# Altium project 05_MCU_LORA.PrjPCB
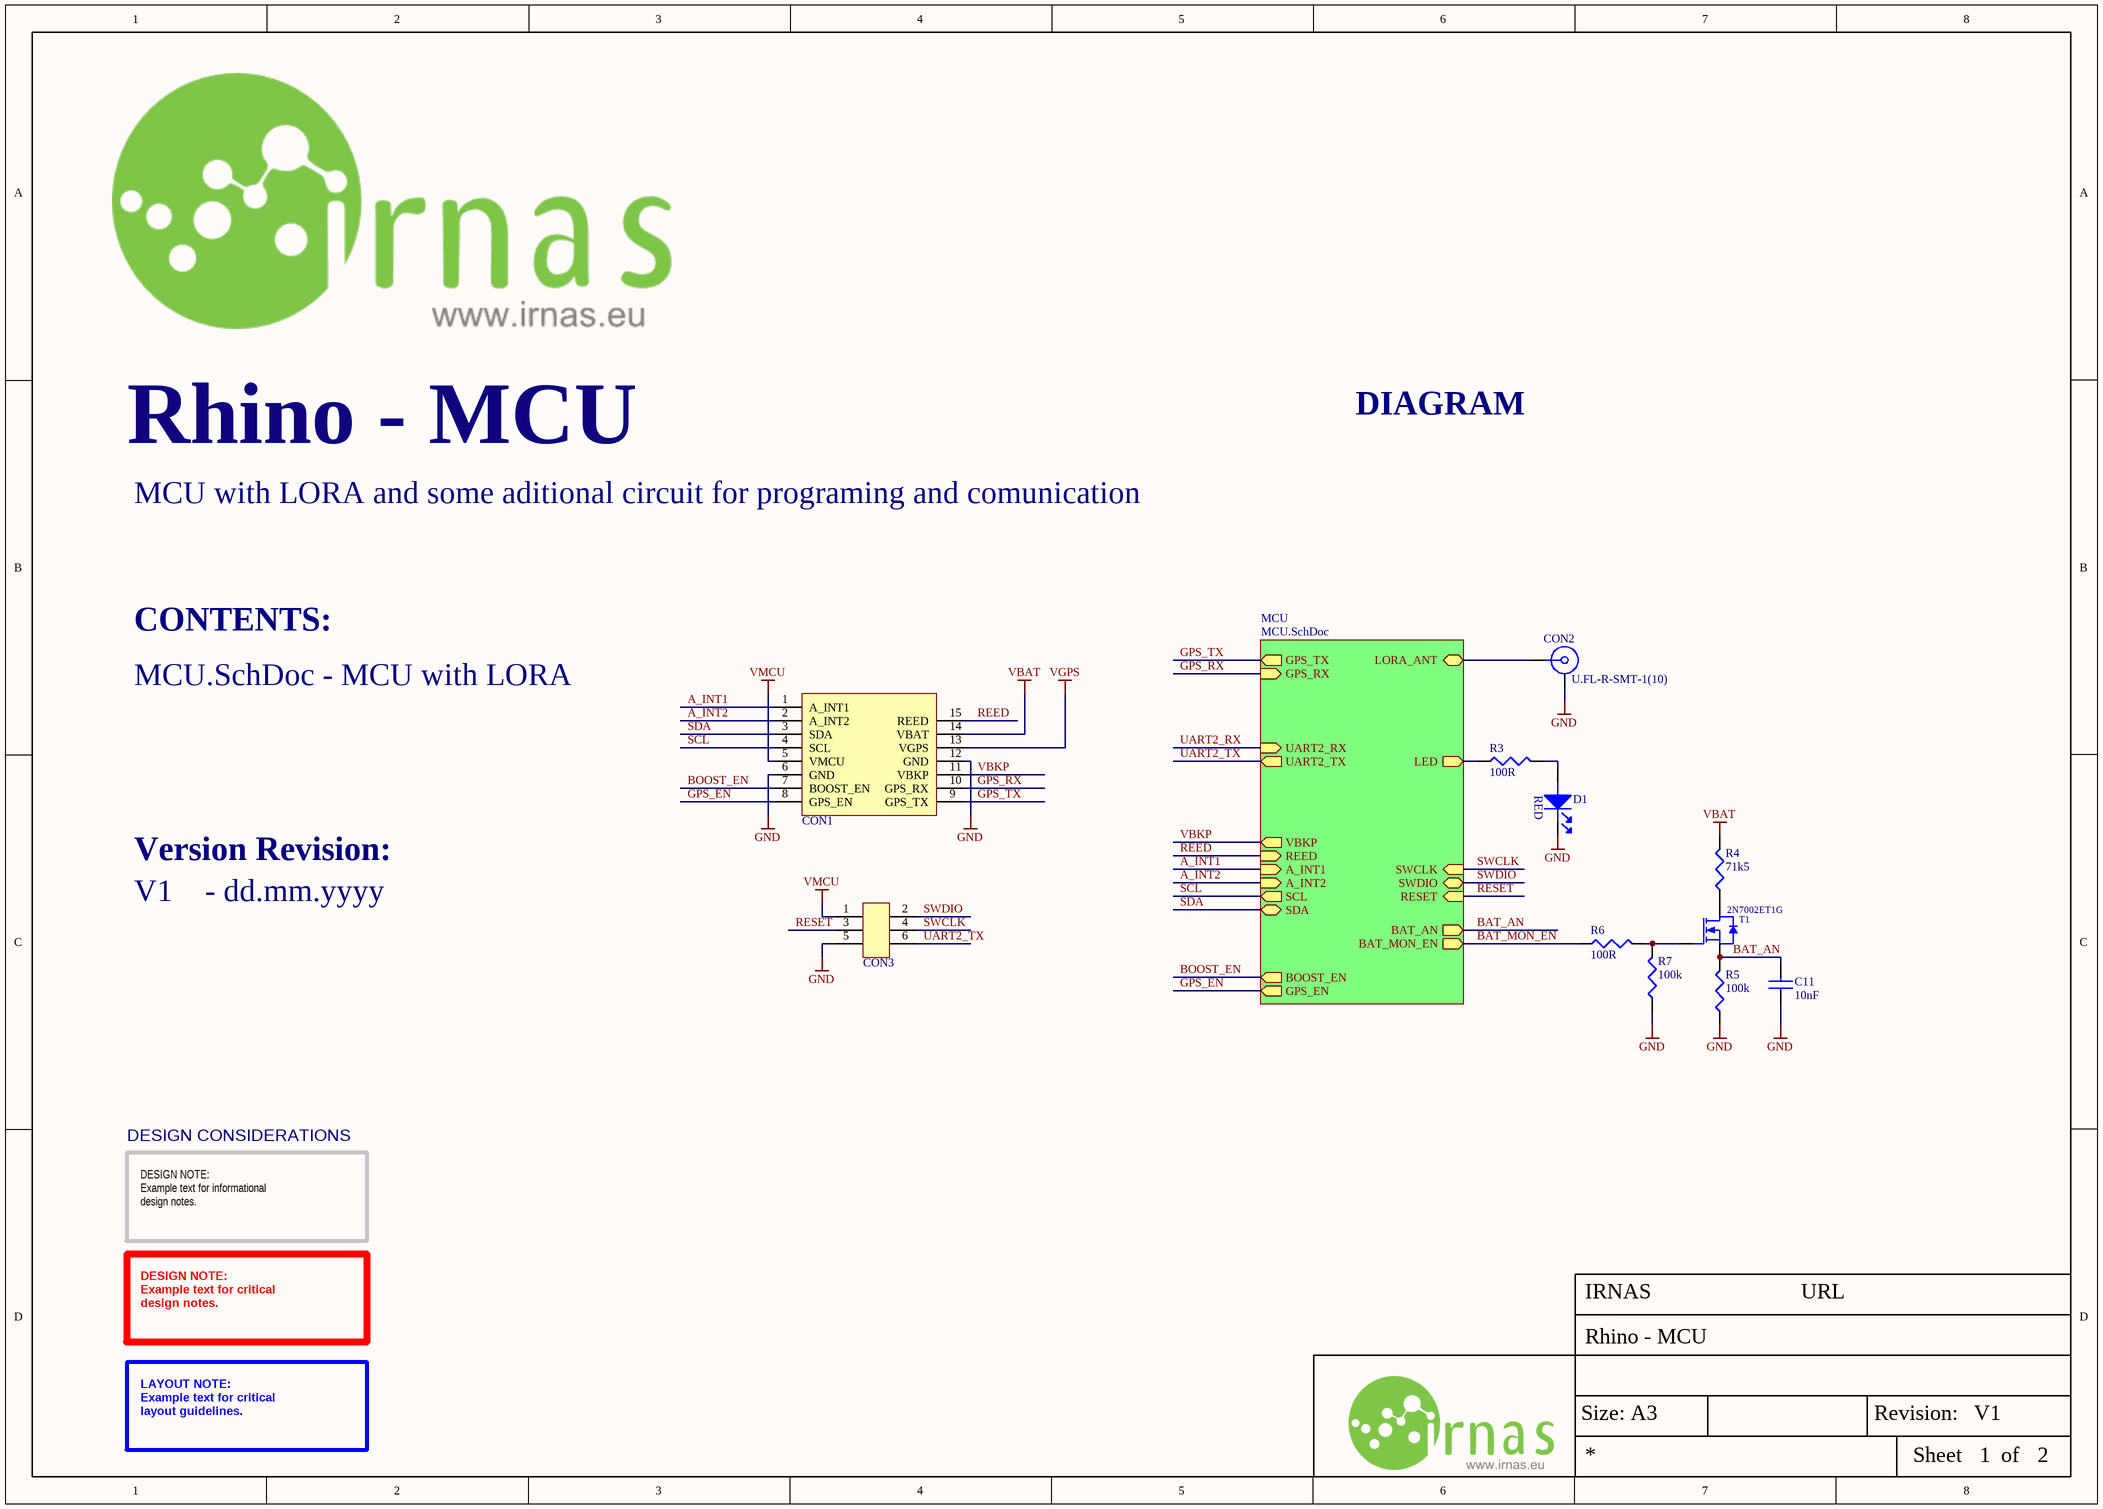
[diagram p0: MAIN_MCU_LORA.SchDoc]
Company: IRNAS; CreateDate: 13.05.2019; PCBDesigner: Aleksej Cegner; ProjectTitle: Rhino - MCU; RevisionDate: dd.mm.yyyy; Version: V1; Website: URL
2 sheets, 20 parts. Net scope: hierarchical (ports join the sheet entries above them; power ports are global).
Board files: MCU_LORA.PcbDoc, Rhino_panel.PcbDoc, Rhino_panel_s.PcbDoc
Sheets:
  MAIN_MCU_LORA.SchDoc
    MCU = MCU.SchDoc

## Sheet MAIN_MCU_LORA.SchDoc
size A3; DocumentNumber: 1; SheetNumber: 1; SheetTotal: 2

### Parts
C11  10nF  [CAP0402]
CON1  Between PCB connection  [SmartParks_Rhino]  (value not drawn)
CON2  U.FL-R-SMT-1(10)  [ufl connector smd]
CON3  Tag connect  [TC2030-IDC-NL]  (value not drawn)  (no BOM)
D1  LED RED  [LED0603]  (value not drawn)
R3  100R  [RES0402]
R4  71k5  [RES0402]
R5  100k  [RES0402]
R6  100R  [RES0402]
R7  100k  [RES0402]
T1  2N7002ET1G  [SOT23-3AL]

### Sub-sheets
MCU = MCU.SchDoc: RESET (in), GPS_RX (in), SCL (out), LORA_ANT (bidir), SWDIO (bidir), GPS_EN (out), GPS_TX (out), SWCLK (in), SDA (bidir), BOOST_EN (out), A_INT2 (in), A_INT1 (in), REED (in), VBKP (out), BAT_AN (out), BAT_MON_EN (out), LED (out), UART2_RX (in), UART2_TX (out)

### Nets
GND: C11.1 CON1.6(GND) CON1.12(GND) CON2.2 CON3.5 D1.1(cathode) R5.1 R7.1
VBAT: CON1.14(VBAT) R4.2
VGPS: CON1.13(VGPS)
VMCU: CON1.5(VMCU) CON3.1
A_INT1: CON1.1(A_INT1) ; sheet MCU/A_INT1
A_INT2: CON1.2(A_INT2) ; sheet MCU/A_INT2
BAT_AN: C11.2 R5.2 T1.2(S) ; sheet MCU/BAT_AN
BAT_MON_EN: R6.1 ; sheet MCU/BAT_MON_EN
BOOST_EN: CON1.7(BOOST_EN) ; sheet MCU/BOOST_EN
GPS_EN: CON1.8(GPS_EN) ; sheet MCU/GPS_EN
GPS_RX: CON1.10(GPS_RX) ; sheet MCU/GPS_RX
GPS_TX: CON1.9(GPS_TX) ; sheet MCU/GPS_TX
LED: R3.1 ; sheet MCU/LED
LORA_ANT: CON2.1 ; sheet MCU/LORA_ANT
REED: CON1.15(REED) ; sheet MCU/REED
RESET: CON3.3 ; sheet MCU/RESET
SCL: CON1.4(SCL) ; sheet MCU/SCL
SDA: CON1.3(SDA) ; sheet MCU/SDA
SWCLK: CON3.4 ; sheet MCU/SWCLK
SWDIO: CON3.2 ; sheet MCU/SWDIO
UART2_TX: CON3.6 ; sheet MCU/UART2_TX
VBKP: CON1.11(VBKP) ; sheet MCU/VBKP
NetD1_2: D1.2(ANODE) R3.2
NetR4_1: R4.1 T1.3(D)
NetR6_2: R6.2 R7.2 T1.1(G)

### Notes on the sheet
- DIAGRAM
- MCU with LORA and some aditional circuit for programing and comunication
- CONTENTS:
- MCU.SchDoc - MCU with LORA
- Version Revision:
- V1    - dd.mm.yyyy
- DESIGN CONSIDERATIONS
- DESIGN NOTE:
  Example text for informational
  design notes.
- DESIGN NOTE:
  Example text for critical
  design notes.
- LAYOUT NOTE:
  Example text for critical
  layout guidelines.
- Size: A3
- Revision:
- Sheet
- of
- (in symbol LED - LED RED) RED

### Library data of the parts
C11 = C - 10nF/0402: CAP CER 10000PF 16V X7R 0402; Manufacturer: Murata; Manufacturer Part Number: GRM155R71C103KA01D; IRNAS Part No.: /; Tolerance: 10%; Supplier 1: Farnell; Stock 1: 16478; Pricing 1: 10=0.0216, 100=0.0151, 500=0.0104, 2500=0.0069, 5000=0.0056 (EUR); Mount: Surface Mount; Case/Package: 0402; Number of Pins: 2; Case Code (Metric): 1005; Case Code (Imperial): 0402; Min Operating Temperature: -55°C; Max Operating Temperature: 125°C; Package Quantity: 1; Capacitance: 10nF; Voltage Rating: 16V; Packaging: Tape and Reel; Voltage Rating (DC): 16V; Dielectric: X7R; Termination: SMD/SMT; Voltage: 16V; Length: 1mm; Height: 0.5mm; Width: 0.02inch; Thickness: 0.022inch; Depth: 0.5mm; Radiation Hardening: No; REACH SVHC: No SVHC; Lead Free: Lead Free; ComponentLink1URL: https://datasheet.ciiva.com/129/partnumbering-e-01-129774.pdf; ComponentLink1Description: https://datasheet.ciiva.com/129/partnumbering-e-01-129774.pdf; ComponentLink2URL: https://datasheet.ciiva.com/129/partnumbering-e-01-129775.pdf; ComponentLink2Description: https://datasheet.ciiva.com/129/partnumbering-e-01-129775.pdf; ComponentLink3URL: https://datasheet.ciiva.com/129/product-129776.pdf; ComponentLink3Description: https://datasheet.ciiva.com/129/product-129776.pdf; ComponentLink4URL: https://datasheet.ciiva.com/18184/getdatasheetpartid-178863-18184649.pdf; ComponentLink4Description: https://datasheet.ciiva.com/18184/getdatasheetpartid-178863-18184649.pdf; ComponentLink5URL: https://datasheet.ciiva.com/22698/608985-22698415.pdf; ComponentLink5Description: https://datasheet.ciiva.com/22698/608985-22698415.pdf; ComponentLink6URL: https://datasheet.ciiva.com/7937/608985-7937614.pdf; ComponentLink6Description: https://datasheet.ciiva.com/7937/608985-7937614.pdf; Supplier Part Number 1: 1828864
CON1 = SmartParks_Rhino
CON2 = U.FL-R-SMT-1(10): RF / Coaxial Connector, U.FL Coaxial, Straight Jack, Surface Mount Vertical, 50 ohm, Brass; Manufacturer: Hirose; Featured Product: U.FL Series Connectors; Connector Style: U.FL, Ultra Miniature Coaxial; Connector Type: Receptacle, Male Pin; Contact Termination: Solder; Impedance: 50 Ohm; Frequency - Max: 6GHz; Body Material: Phosphor Bronze; Body Finish: Silver; Center Contact Plating: Gold; Dielectric Material: Liquid Crystal Polymer (LCP); Online Catalog: UMCC (Ultra Miniature Coax Connectors), U.FL Series; Other Names: H11891TR  Q5400621  U.FL-R-SMT-1 10  U.FL-R-SMT-1(10)-ND  UFLRSMT110; Supplier 1: Farnell; Manufacturer Part Number: U.FL-R-SMT-1(10); Stock 1: 0; Standard Package: 2,500; Category: Connectors, Interconnects; Family: Coaxial Connectors (RF); Series: U.FL; Packaging: Tape & Reel (TR); Shield Termination: Solder; Mounting Type: Surface Mount; Cable Group: -; Fastening Type: Snap-On; Features: -; Housing Color: Beige; Ingress Protection: -; Center Contact Material: Brass; Voltage Rating: -; Operating Temperature: -40°C ~ 90°C; ComponentLink1URL: http://www.farnell.com/datasheets/91524.pdf; ComponentLink1Description: http://www.farnell.com/datasheets/91524.pdf; ComponentLink2URL: http://uk.rs-online.com/webdocs/1363/0900766b81363563.pdf; ComponentLink2Description: http://uk.rs-online.com/webdocs/1363/0900766b81363563.pdf; ComponentLink3URL: http://www.farnell.com/datasheets/1947917.pdf; ComponentLink3Description: http://www.farnell.com/datasheets/1947917.pdf; Supplier Part Number 1: 1688077
CON3 = tag connecot 6 pin
D1 = LED - LED RED: BROADCOM LIMITED - HSMS-C190 - LED, RED, 10MCD, 626NM; LED Mounting: SMD; Forward Current If: 20; Forward Voltage: 2.1; Wavelength Typ: 626; Luminous Intensity: 10; Viewing Angle: 170°; Lens Shape: Rectangular; SVHC: No SVHC (17-Dec-2015)<!--FANDB--><div class="features-and-benefits-container"><div class="features-and-benefits-description"><span class="features-benefits-value">The HSMS-C190 is a HER SMD Chip LED with untinted/diffused lens, made of GaP. It is designed in an industry standard package 1.6 x 0.8mm footprint with 0.8mm profile. It is compatible with IR reflow solder processes. The small size and wide viewing angle make this LED prime choices for backlighting applications and front panel illumination especially where space is a premium.</span></div><div class="features-and-benefits-list"><ul class="features-and-benefits-list-list"><li class="features-and-benefits-list-item">Small size</li><li class="features-and-benefits-list-item">Industry standard footprint</li><li class="features-and-benefits-list-item">Compatible with IR solder</li><li class="features-and-benefits-list-item">Diffused optics</li><li class="features-and-benefits-list-item">-40 to 85; Supplier 1: Farnell; Manufacturer: BROADCOM LIMITED; Manufacturer Part Number: HSMS-C190; RoHS: YES; Stock 1: 7534; Pricing 1: 1=0.361, 10=0.256, 50=0.235, 100=0.106, 200=0.101 (GBP); LED Colour: Red; Bulb Size: -; Packaging: Cut Tape; Product Range: -; Automotive Qualification Standard: -; MSL: -; ComponentLink1URL: http://www.farnell.com/datasheets/313031.pdf; ComponentLink1Description: http://www.farnell.com/datasheets/313031.pdf; ComponentLink2URL: http://www.farnell.com/datasheets/1681524.pdf; ComponentLink2Description: http://www.farnell.com/datasheets/1681524.pdf; ComponentLink3URL: http://www.farnell.com/datasheets/2165483.pdf; ComponentLink3Description: http://www.farnell.com/datasheets/2165483.pdf; Supplier Part Number 1: 2497356
R3 R6 = R - 100R/0402: MULTICOMP         MCMR04X1000FTL            SMD Chip Resistor, Ceramic, MCMR Series, 100 ohm, 50 V, 0402 [1005 Metric], 62.5 mW,  1%; IRNAS Part No.: /; Temperature Coefficient: 100ppm/°C; Power Rating: 62.5mW; Voltage Rating: 50V; Supplier 1: Farnell; Manufacturer: Multicomp; Manufacturer Part Number: MCMR04X1000FTL; Stock 1: 62365; Pricing 1: 10=0.0071, 100=0.0042, 500=0.003, 2500=0.0024, 5000=0.0019 (GBP); Case/Package: 0402; Case Code (Metric): 1005; Case Code (Imperial): 0402; Resistance: 100R; Tolerance: 1%; Composition: Ceramic; Packaging: Cut Tape; Voltage Rating (DC): 50V; REACH SVHC: No SVHC; ComponentLink1URL: https://datasheet.ciiva.com/28692/1716705-28692087.pdf; ComponentLink1Description: https://datasheet.ciiva.com/28692/1716705-28692087.pdf; ComponentLink2URL: https://datasheet.ciiva.com/22708/1716705-22708156.pdf; ComponentLink2Description: https://datasheet.ciiva.com/22708/1716705-22708156.pdf; Supplier Part Number 1: 2072515
R4 = R - 71k5/0402: MULTICOMP         MCMR04X7152FTL            Surface Mount Chip Resistor, Ceramic, MCMR Series, 71.5 kohm, 62.5 mW,  1%, 50 V; IRNAS Part No.: /; Resistance: 71.5kR; Power Rating: 62.5mW; Voltage Rating: 50V; Temperature Coefficient: 100ppm/°C; Manufacturer: Multicomp; Manufacturer Part Number: MCMR04X7152FTL; Stock 1: 34671; Pricing 1: 10=0.0054, 100=0.0048, 500=0.0041, 2500=0.0029, 5000=0.0023, 10000=0.002, 50000=0.0015 (EUR); Case/Package: 0402; Case Code (Metric): 1005; Case Code (Imperial): 0402; Packaging: Cut Tape; Tolerance: 1%; Composition: Ceramic; Voltage Rating (DC): 50V; REACH SVHC: No SVHC; ComponentLink1URL: https://datasheet.ciiva.com/28672/1716706-28672249.pdf; ComponentLink1Description: https://datasheet.ciiva.com/28672/1716706-28672249.pdf; Supplier 1: Farnell; Supplier Part Number 1: 2073227
R5 R7 = R - 100k/0402: MULTICOMP   MCWR04X1003FTL   RES, THICK FILM, 100KOHM, 1%, 0.0625W; IRNAS Part No.: I-100013; Resistance: 100kR; Power Rating: 62.5mW; Voltage Rating: 50V; Temperature Coefficient: 100ppm/°C; Supplier 1: Farnell; Manufacturer: Multicomp; Manufacturer Part Number: MCWR04X1003FTL; Stock 1: 161188; Pricing 1: 10=0.0029, 100=0.0017, 500=0.0012, 2500=0.001, 5000=0.0008 (EUR); Mount: Surface Mount; Case/Package: 0402; Case Code (Metric): 1005; Case Code (Imperial): 0402; Tolerance: 1%; Packaging: Cut Tape; Composition: Thick Film; Voltage Rating (DC): 50V; REACH SVHC: No SVHC; ComponentLink1URL: https://datasheet.ciiva.com/46386/1849611-46386524.pdf; ComponentLink1Description: https://datasheet.ciiva.com/46386/1849611-46386524.pdf; Supplier Part Number 1: 2447094
T1 = T_M - 2N7002ET1G: MOSFET Transistor, N Channel, 310 mA, 60 V, 0.86 ohm, 10 V, 1 V; ELRAD Id sifra / ELRAD Id No: 597778; Opis / Description: MOSFET BSS123       /N-Channel; Komp / Device: SMD; Value: BSS123; Velikost / Size: SOT23; FIT: 0.44; Author: Ciril Golob; ComponentLink1Description: Datasheet; ComponentLink1URL: C:\ELRADSVN\Altium_Library\Libraries\Active\Datasheet\2N7002ET1G.pdf; Date: 11.07.2018; ComponentLINK1Description: Datasheet; ComponentLINK2Description: Datasheet www; ComponentLINK1URL: c:\ELRADSVN\Altium_Library\Libraries\Active\Datasheet\BSS123.pdf; ComponentLINK2URL: http://www.onsemi.com/pub/Collateral/BSS123-D.PDF; Supplier 1: Farnell; Supplier Part Number 1: 2317616; Supplier 2: Mouser; Supplier Part Number 2: 863-2N7002ET1G

## Sheet MCU.SchDoc
size A3; DocumentNumber: 2; SheetNumber: 2; SheetTotal: 2
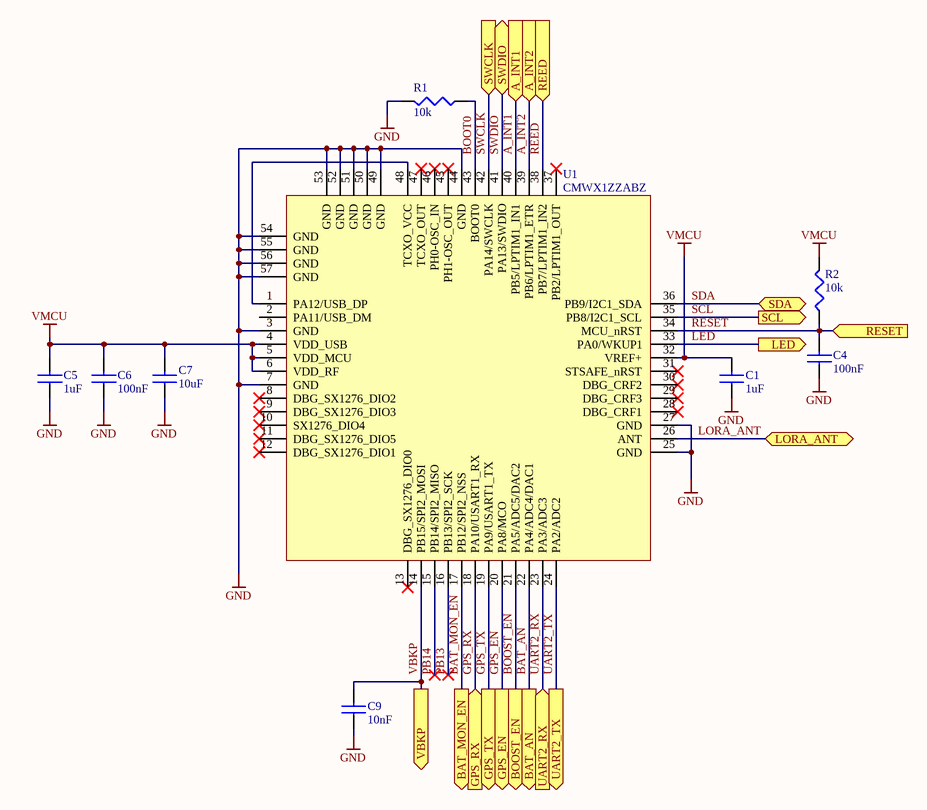
[diagram p1: MCU.SchDoc]

### Parts
C1  1uF  [CAP0402]
C4  100nF  [CAP0402]
C5  1uF  [CAP0402]
C6  100nF  [CAP0402]
C7  10uF  [CAP0603]
C9  10nF  [CAP0402]
R1  10k  [RES0402]
R2  10k  [RES0402]
U1  CMWX1ZZABZ  [Lora Module ES0]

### Ports
A_INT1 (in), A_INT2 (in), BAT_AN (out), BAT_MON_EN (out), BOOST_EN (out), GPS_EN (out), GPS_RX (in), GPS_TX (out), LED (out), LORA_ANT (bidir), REED (in), RESET (in), SCL (out), SDA (bidir), SWCLK (in), SWDIO (bidir), UART2_RX (in), UART2_TX (out), VBKP (out)

### Nets
GND: C1.1 C4.1 C5.1 C6.1 C7.1 C9.1 R1.2 U1.3(GND) U1.7(GND) U1.25(GND) U1.27(GND) U1.44(GND) U1.49(GND) U1.50(GND) U1.51(GND) U1.52(GND) U1.53(GND) U1.54(GND) U1.55(GND) U1.56(GND) U1.57(GND)
VMCU: C1.2 C5.2 C6.2 C7.2 R2.2 U1.4(VDD_USB) U1.5(VDD_MCU) U1.6(VDD_RF) U1.32(VREF+)
A_INT1: U1.40(PB5/LPTIM1_IN1) ; port A_INT1
A_INT2: U1.39(PB6/LPTIM1_ETR) ; port A_INT2
BAT_AN: U1.22(PA4/ADC4/DAC1) ; port BAT_AN
BAT_MON_EN: U1.17(PB12/SPI2_NSS) ; port BAT_MON_EN
BOOST_EN: U1.21(PA5/ADC5/DAC2) ; port BOOST_EN
BOOT0: R1.1 U1.43(BOOT0)
GPS_EN: U1.20(PA8/MCO) ; port GPS_EN
GPS_RX: U1.18(PA10/USART1_RX) ; port GPS_RX
GPS_TX: U1.19(PA9/USART1_TX) ; port GPS_TX
LED: U1.33(PA0/WKUP1) ; port LED
LORA_ANT: U1.26(ANT) ; port LORA_ANT
PB13: U1.16(PB13/SPI2_SCK)
PB14: U1.15(PB14/SPI2_MISO)
REED: U1.38(PB7/LPTIM1_IN2) ; port REED
RESET: C4.2 R2.1 U1.34(MCU_nRST) ; port RESET
SCL: U1.35(PB8/I2C1_SCL) ; port SCL
SDA: U1.36(PB9/I2C1_SDA) ; port SDA
SWCLK: U1.42(PA14/SWCLK) ; port SWCLK
SWDIO: U1.41(PA13/SWDIO) ; port SWDIO
UART2_RX: U1.23(PA3/ADC3) ; port UART2_RX
UART2_TX: U1.24(PA2/ADC2) ; port UART2_TX
VBKP: C9.2 U1.14(PB15/SPI2_MOSI) ; port VBKP
NetU1_1: U1.1(PA12/USB_DP) U1.48(TCXO_VCC)

Not connected (* = marked no-connect by the designer): U1 2(PA11/USB_DM) 8(DBG_SX1276_DIO2)* 9(DBG_SX1276_DIO3)* 10(SX1276_DIO4)* 11(DBG_SX1276_DIO5)* 12(DBG_SX1276_DIO1)* 13(DBG_SX1276_DIO0)* 28(DBG_CRF1)* 29(DBG_CRF3)* 30(DBG_CRF2)* 31(STSAFE_nRST)* 37(PB2/LPTIM1_OUT)* 45(PH1-OSC_OUT)* 46(PH0-OSC_IN)* 47(TCXO_OUT)*

### Notes on the sheet
- Size: A3
- Revision:
- Sheet
- of

### Library data of the parts
C1 C5 = C - 1uF/0402: CAP CER 1UF 10V 20% X5R 0402; Manufacturer: Murata; Manufacturer Part Number: GRM155R61A105ME15D; IRNAS Part No.: /; Stock 1: 0; Pricing 1: 10=0.0379, 100=0.0266, 500=0.0156, 2500=0.0098, 5000=0.0083 (EUR); Mount: Surface Mount; Case/Package: 0402; Case Code (Metric): 1005; Case Code (Imperial): 0402; Min Operating Temperature: -55°C; Max Operating Temperature: 85°C; Capacitance: 1uF; Tolerance: 20%; Voltage Rating: 10V; Packaging: Tape and Reel; Package Quantity: 1; Dielectric: X5R; Voltage: 10V; Voltage Rating (DC): 10V; Length: 1mm; Height: 0.5mm; Width: 0.02inch; Thickness: 0.022inch; Depth: 0.5mm; Radiation Hardening: No; REACH SVHC: No SVHC; Lead Free: Lead Free; ComponentLink1URL: https://datasheet.ciiva.com/164/product-164665.pdf; ComponentLink1Description: https://datasheet.ciiva.com/164/product-164665.pdf; ComponentLink2URL: https://datasheet.ciiva.com/11616/product-11616508.pdf; ComponentLink2Description: https://datasheet.ciiva.com/11616/product-11616508.pdf; ComponentLink3URL: https://datasheet.ciiva.com/46418/1769893-46418047.pdf; ComponentLink3Description: https://datasheet.ciiva.com/46418/1769893-46418047.pdf; ComponentLink4URL: https://datasheet.ciiva.com/164/partnumbering-e-01-164666.pdf; ComponentLink4Description: https://datasheet.ciiva.com/164/partnumbering-e-01-164666.pdf; ComponentLink5URL: https://datasheet.ciiva.com/164/partnumbering-e-01-164667.pdf; ComponentLink5Description: https://datasheet.ciiva.com/164/partnumbering-e-01-164667.pdf; Supplier 1: Farnell; Supplier Part Number 1: 1740588
C4 C6 = C - 100nF/0402: MULTICOMP         MC0402X104J160CT             SMD Multilayer Ceramic Capacitor, 0402 [1005 Metric], 0.1 F, 16 V,  5%, X5R, MC Series                          New; IRNAS Part No.: /; Voltage Rating: 16V; Supplier 1: Farnell; Manufacturer: Multicomp; Manufacturer Part Number: MC0402X104J160CT; Stock 1: 3230; Pricing 1: 10=0.0139, 100=0.0108, 500=0.0076, 2500=0.0051, 5000=0.0038 (EUR); Case Code (Metric): 1005; Case Code (Imperial): 0402; Min Operating Temperature: -55°C; Max Operating Temperature: 85°C; Capacitance: 100nF; Dielectric: X5R; Packaging: Tape and Reel; Tolerance: 5%; Voltage Rating (DC): 16V; REACH SVHC: No SVHC; ComponentLink1URL: http://www.farnell.com/datasheets/2117933.pdf; ComponentLink1Description: http://www.farnell.com/datasheets/2117933.pdf; ComponentLink2URL: http://www.farnell.com/datasheets/2117900.pdf; ComponentLink2Description: http://www.farnell.com/datasheets/2117900.pdf; Supplier Part Number 1: 2627419
C7 = 10uF: 10uf/0603/20%; Manufacturer: KEMET; Manufacturer Part Number: C0603C106M8PACTU; Stock 1: 0; Pricing 1: 10=0.555, 100=0.315, 500=0.238, 1000=0.2, 2000=0.174, 4000=0.143, 20000=0.123 (GBP); Supplier 1: Farnell; Supplier Part Number 1: 2456110
C9 = C - 10nF/0402: as C11 on sheet MAIN_MCU_LORA; Supplier 1: Farnell; Stock 1: 16478; Pricing 1: 10=0.0216, 100=0.0151, 500=0.0104, 2500=0.0069, 5000=0.0056 (EUR); Mount: Surface Mount; Case/Package: 0402; Number of Pins: 2; Case Code (Metric): 1005; Case Code (Imperial): 0402; Min Operating Temperature: -55°C; Max Operating Temperature: 125°C; Package Quantity: 1; Capacitance: 10nF; Voltage Rating: 16V; Packaging: Tape and Reel; Voltage Rating (DC): 16V; Dielectric: X7R; Termination: SMD/SMT; Voltage: 16V; Length: 1mm; Height: 0.5mm; Width: 0.02inch; Thickness: 0.022inch; Depth: 0.5mm; Radiation Hardening: No; REACH SVHC: No SVHC; Lead Free: Lead Free; ComponentLink1URL: https://datasheet.ciiva.com/129/partnumbering-e-01-129774.pdf; ComponentLink1Description: https://datasheet.ciiva.com/129/partnumbering-e-01-129774.pdf; ComponentLink2URL: https://datasheet.ciiva.com/129/partnumbering-e-01-129775.pdf; ComponentLink2Description: https://datasheet.ciiva.com/129/partnumbering-e-01-129775.pdf; ComponentLink3URL: https://datasheet.ciiva.com/129/product-129776.pdf; ComponentLink3Description: https://datasheet.ciiva.com/129/product-129776.pdf; ComponentLink4URL: https://datasheet.ciiva.com/18184/getdatasheetpartid-178863-18184649.pdf; ComponentLink4Description: https://datasheet.ciiva.com/18184/getdatasheetpartid-178863-18184649.pdf; ComponentLink5URL: https://datasheet.ciiva.com/22698/608985-22698415.pdf; ComponentLink5Description: https://datasheet.ciiva.com/22698/608985-22698415.pdf; ComponentLink6URL: https://datasheet.ciiva.com/7937/608985-7937614.pdf; ComponentLink6Description: https://datasheet.ciiva.com/7937/608985-7937614.pdf; Supplier Part Number 1: 1828864
R1 R2 = R - 10k/0402: MULTICOMP         MCWR04X1002FTL             SMD Chip Resistor, Thick Film, 10 kohm, 50 V, 0402 [1005 Metric], 62.5 mW,  1%, MCWR Series; IRNAS Part No.: I-100014; Resistance: 10kR; Voltage Rating: 50V; Power Rating: 62.5mW; Temperature Coefficient: 100ppm/°C; Supplier 1: Farnell; Manufacturer: Multicomp; Manufacturer Part Number: MCWR04X1002FTL; Stock 1: 602609; Pricing 1: 10=0.0029, 100=0.0017, 500=0.0012, 2500=0.001, 5000=0.0008 (EUR); Case/Package: 0402; Case Code (Metric): 1005; Case Code (Imperial): 0402; Packaging: Cut Tape; Composition: Thick Film; Tolerance: 1%; Voltage Rating (DC): 50V; REACH SVHC: No SVHC; ComponentLink1URL: http://www.farnell.com/datasheets/1849611.pdf; ComponentLink1Description: http://www.farnell.com/datasheets/1849611.pdf; Supplier Part Number 1: 2447096
U1 = MCU - CMWX1ZZABZ: RF Module, FSK, OOK, LoRa, 4.8Kbps, 915MHz, -135.5dBm, 2.2V to 3.6V, I2C, SPI, UART, USB; Manufacturer: Murata; Manufacturer Part Number: CMWX1ZZABZ-091; Stock 1: 175; Pricing 1: 1=11.7, 5=11.06, 10=9.94, 50=9.54, 100=9.14, 250=8.05 (GBP); ComponentLink1Description: Datasheet; ComponentLink1URL: D:\altium\Altium_Library\Active\Datasheet\CMWX1ZZABZ.pdf; Supplier 1: Farnell; Supplier Part Number 1: 2802546; Supplier 2: Mouser; Supplier Part Number 2: 81-CMWX1ZZABZ-091

## Nets that join several sheets
GND: MAIN_MCU_LORA (8 pins), MCU (21 pins)
VMCU: MAIN_MCU_LORA (CON1.5 CON3.1), MCU (9 pins)
A_INT1: MAIN_MCU_LORA (CON1.1), MCU (U1.40)
A_INT2: MAIN_MCU_LORA (CON1.2), MCU (U1.39)
BAT_AN: MAIN_MCU_LORA (C11.2 R5.2 T1.2), MCU (U1.22)
BAT_MON_EN: MAIN_MCU_LORA (R6.1), MCU (U1.17)
BOOST_EN: MAIN_MCU_LORA (CON1.7), MCU (U1.21)
GPS_EN: MAIN_MCU_LORA (CON1.8), MCU (U1.20)
GPS_RX: MAIN_MCU_LORA (CON1.10), MCU (U1.18)
GPS_TX: MAIN_MCU_LORA (CON1.9), MCU (U1.19)
LED: MAIN_MCU_LORA (R3.1), MCU (U1.33)
LORA_ANT: MAIN_MCU_LORA (CON2.1), MCU (U1.26)
REED: MAIN_MCU_LORA (CON1.15), MCU (U1.38)
RESET: MAIN_MCU_LORA (CON3.3), MCU (C4.2 R2.1 U1.34)
SCL: MAIN_MCU_LORA (CON1.4), MCU (U1.35)
SDA: MAIN_MCU_LORA (CON1.3), MCU (U1.36)
SWCLK: MAIN_MCU_LORA (CON3.4), MCU (U1.42)
SWDIO: MAIN_MCU_LORA (CON3.2), MCU (U1.41)
UART2_TX: MAIN_MCU_LORA (CON3.6), MCU (U1.24)
VBKP: MAIN_MCU_LORA (CON1.11), MCU (C9.2 U1.14)

## Assembly variants
BASIC: not fitted C2 C3 C? C?